# Altium project GMM_TESTER_PA.PrjPcb
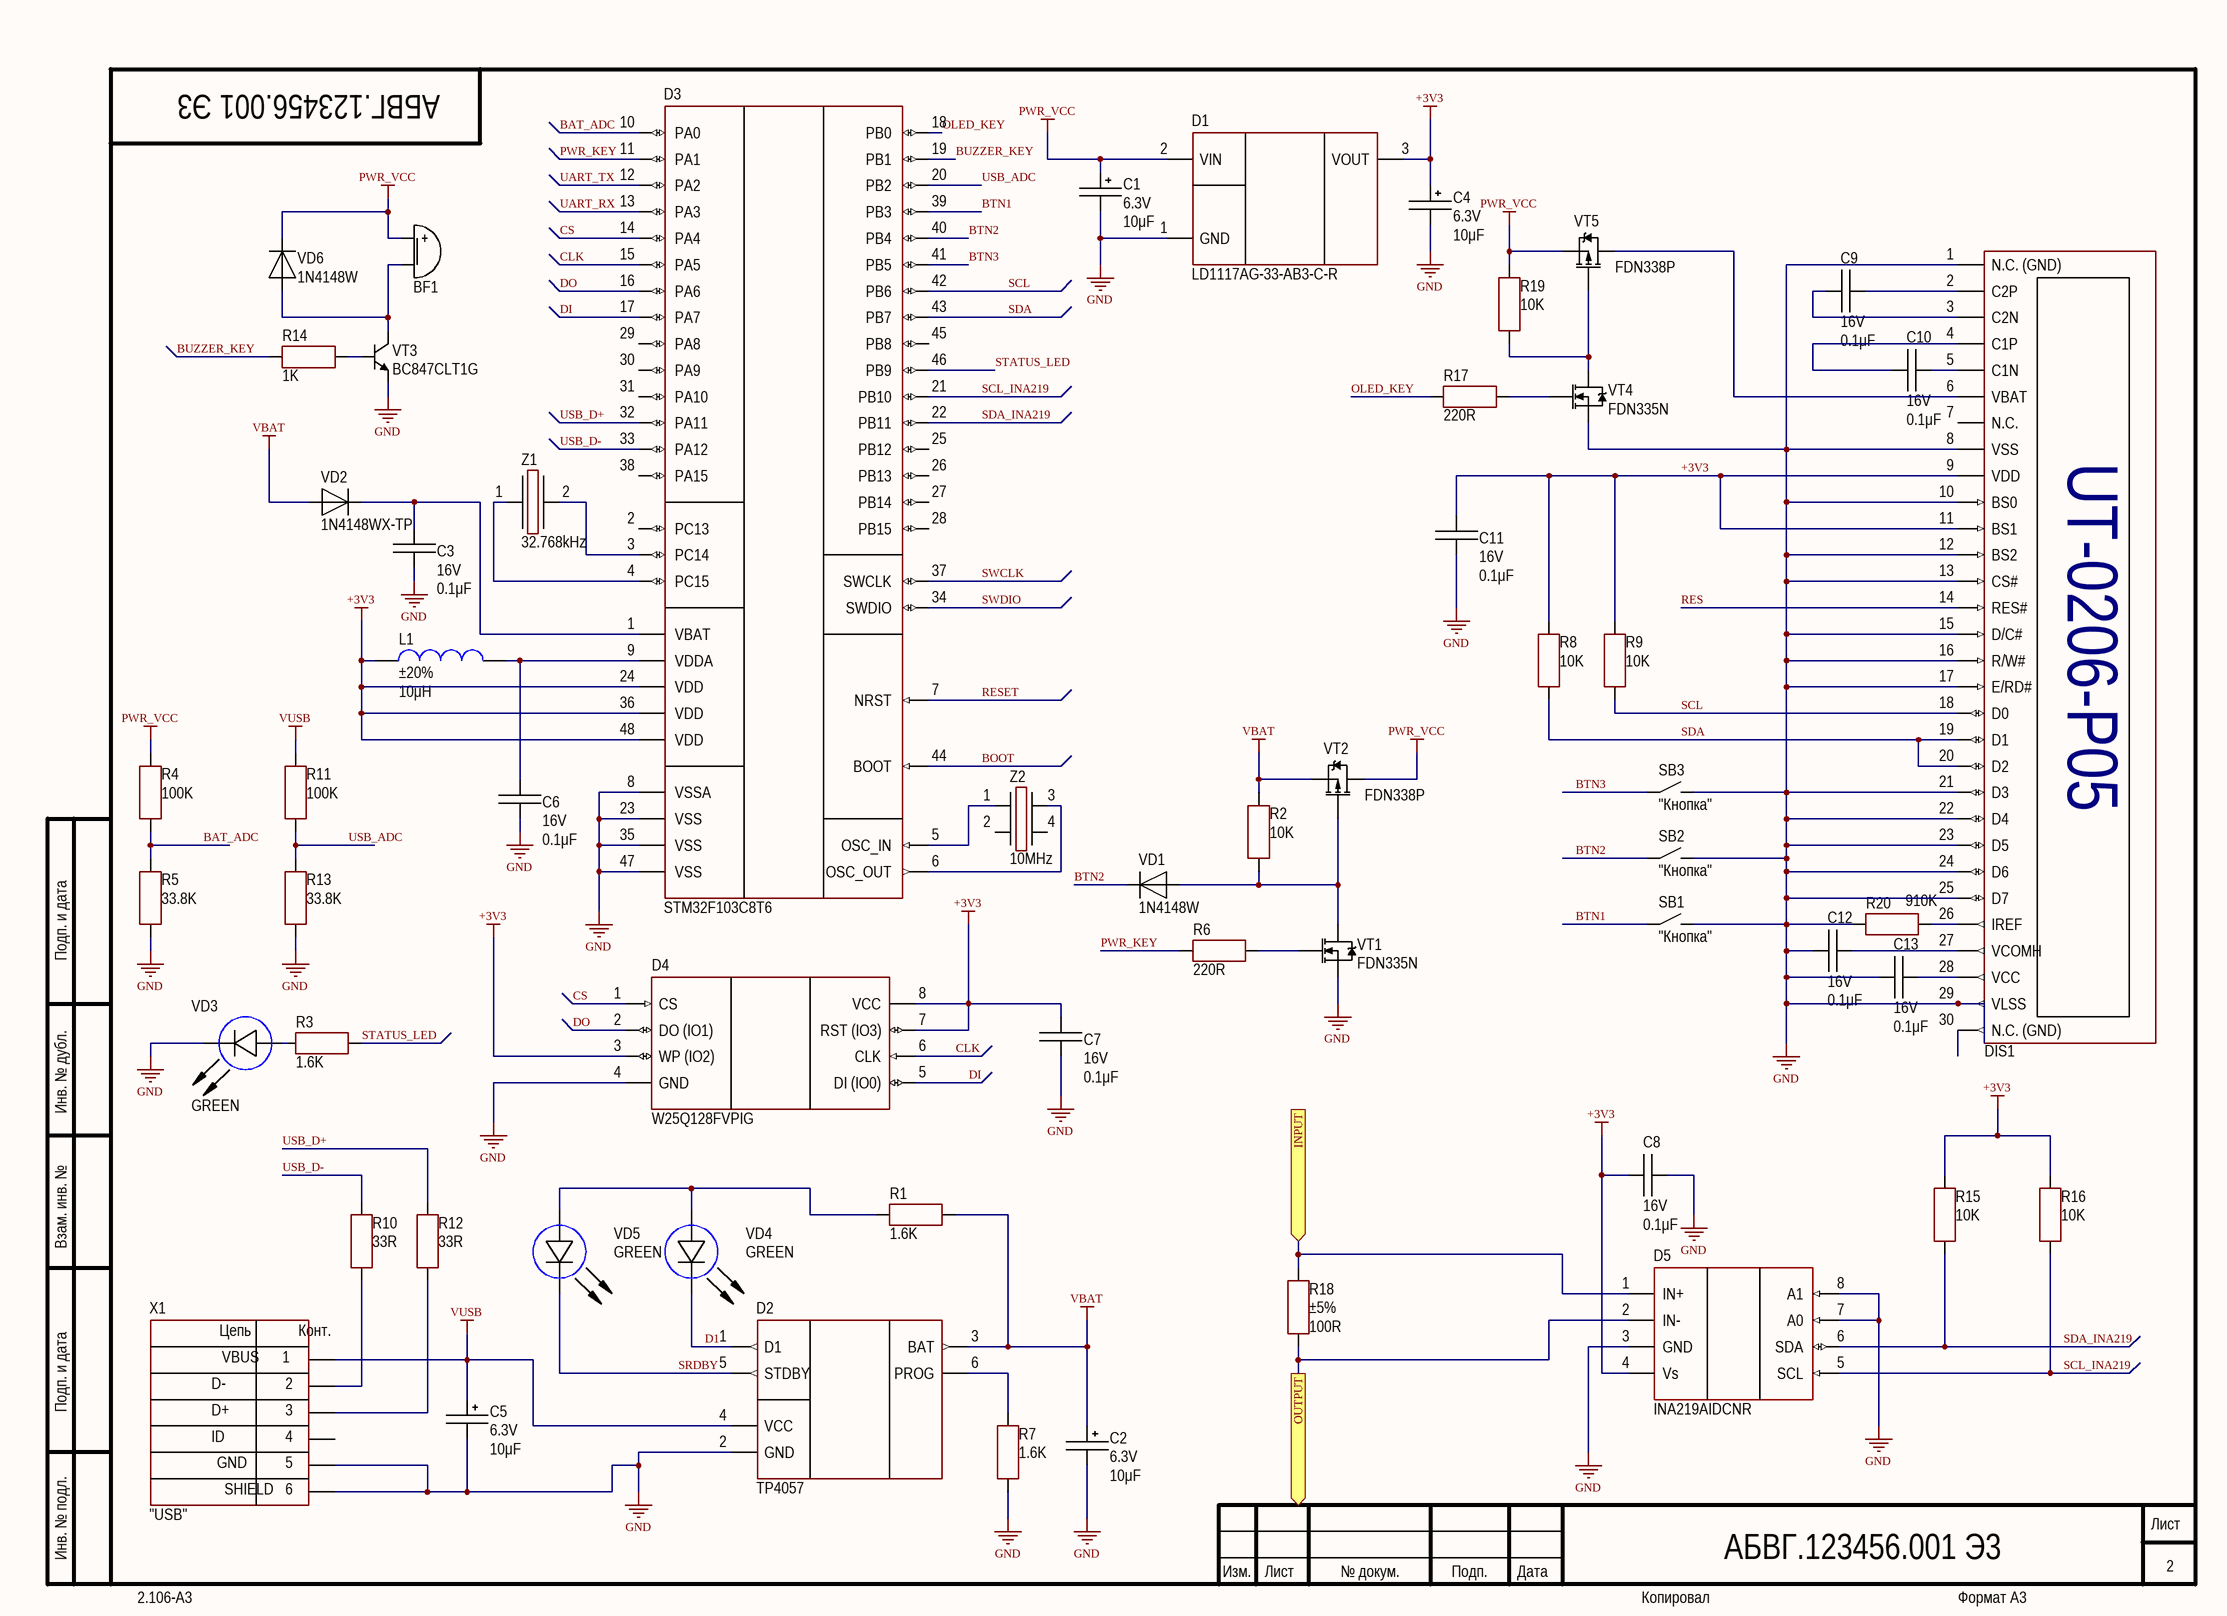
[diagram p0: GMM_TESTER_PA_Sheet1.SchDoc]
2 sheets, 58 parts. Net scope: flat (ports and power ports of the same name join across sheets).
Board file: GMM_TESTER_PA_PCB.PcbDoc
Sheets:
  GMM_TESTER_PA_Sheet1.SchDoc
  GMM_TESTER_PA_Sheet2.SchDoc

## Sheet GMM_TESTER_PA_Sheet1.SchDoc
size 420 x 297 mm; Address1: Address1; Address2: Address2; Address3: Address3; Address4: Address4; DocumentNumber: АБВГ.123456.001 Э3; SheetNumber: 2; Scale: 1:1; DocumentType: Схема электрическая принципиальная; FirstReferrence: АБВГ.123456.001

### Parts
BF1  (no value)  [BUZ: CMT-7525]
C1  value 10μF  Voltage: 6.3V  [CAP: TANTAL-A]
C2  value 10μF  Voltage: 6.3V  [CAP: TANTAL-A]
C3  value 0.1μF  Voltage: 16V  [CAP: 0603]
C4  value 10μF  Voltage: 6.3V  [CAP: TANTAL-A]
C5  value 10μF  Voltage: 6.3V  [CAP: TANTAL-A]
C6  value 0.1μF  Voltage: 16V  [CAP: 0603]
C7  value 0.1μF  Voltage: 16V  [CAP: 0603]
C8  value 0.1μF  Voltage: 16V  [CAP: 0603]
C9  value 0.1μF  Voltage: 16V  [CAP: 0603]
C10  value 0.1μF  Voltage: 16V  [CAP: 0603]
C11  value 0.1μF  Voltage: 16V  [CAP: 0603]
C12  value 0.1μF  Voltage: 16V  [CAP: 0603]
C13  value 0.1μF  Voltage: 16V  [CAP: 0603]
D1  (no value)  [SOT89]
D2  (no value)  [SOT23-6]
D3  (no value)  [48-LQFP]
D4  (no value)  [8-SOIC]
D5  (no value)  [SOT23-8]
DIS1  (no value)  [DISP: OLED UT-0206-P05]
L1  value 10μH  Tolerance: ±20%  [IND: 0603]
R1  value 1.6K  [RES: 0603]
R2  value 10K  [RES: 0603]
R3  value 1.6K  [RES: 0603]
R4  value 100K  [RES: 0603]
R5  value 33.8K  [RES: 0603]
R6  value 220R  [RES: 0603]
R7  value 1.6K  [RES: 0603]
R8  value 10K  [RES: 0603]
R9  value 10K  [RES: 0603]
R10  value 33R  [RES: 0603]
R11  value 100K  [RES: 0603]
R12  value 33R  [RES: 0603]
R13  value 33.8K  [RES: 0603]
R14  value 1K  [RES: 0603]
R15  value 10K  [RES: 0603]
R16  value 10K  [RES: 0603]
R17  value 220R  [RES: 0603]
R18  value 100R  Tolerance: ±5%  [RES: 1206]
R19  value 10K  [RES: 0603]
R20  value 910K  [RES: 0603]
SB1  CommentText: "Кнопка"  [BUT: SKQGADE010 - duplicate]
SB2  CommentText: "Кнопка"  [BUT: SKQGADE010 - duplicate]
SB3  CommentText: "Кнопка"  [BUT: SKQGADE010 - duplicate]
VD1  PartNumber: 1N4148W  [DIODE: SOD123]
VD2  PartNumber: 1N4148WX-TP  [DIODE: SOD123]
VD3  Color: GREEN  [LED: 0805R]
VD4  Color: GREEN  [LED: 0805G]
VD5  Color: GREEN  [LED: 0805R]
VD6  PartNumber: 1N4148W  [DIODE: SOD123]
VT1  PartNumber: FDN335N  [SOT23]
VT2  PartNumber: FDN338P  [SOT23]
VT3  PartNumber: BC847CLT1G  [SOT23]
VT4  PartNumber: FDN335N  [SOT23]
VT5  PartNumber: FDN338P  [SOT23]
X1  CommentText: "USB"  [CON: USB micro-A (ZX62-B-5PA)]
Z1  Frequency: 32.768kHz  [OSC: FC - 12M]
Z2  Frequency: 10MHz  [OSC: 3225]

### Ports
INPUT (in), OUTPUT (out)

### Nets
+3V3: C4.1 C7.1 C8.2 C11.1 D1.3(VOUT) D3.24(VDD) D3.36(VDD) D3.48(VDD) D4.3(WP_(IO2)) D4.7(RST_(IO3)) D4.8(VCC) D5.4(Vs) DIS1.9(VDD) DIS1.11(BS1) L1.2 R8.2 R9.2 R15.2 R16.2
GND: C1.2 C2.2 C3.2 C4.2 C5.2 C6.2 C7.2 C8.1 C11.2 C12.2 C13.2 D1.1(GND) D2.2(GND) D3.8(VSSA) D3.23(VSS) D3.35(VSS) D3.47(VSS) D4.4(GND) D5.3(GND) D5.7(A0) D5.8(A1) DIS1.1(N.C._(GND)) DIS1.8(VSS) DIS1.10(BS0) DIS1.12(BS2) DIS1.13(CS#) DIS1.15(D/C#) DIS1.16(R/W#) DIS1.17(E/RD#) DIS1.21(D3) DIS1.22(D4) DIS1.23(D5) DIS1.24(D6) DIS1.25(D7) DIS1.29(VLSS) R5.1 R7.1 R13.1 R20.1 SB1.2 SB2.2 SB3.2 VD3.2(C) VT1.2(S) VT3.2(E) VT4.2(S) X1.0 X1.5
PWR_VCC: BF1.1(+) C1.1 D1.2(VIN) R4.2 R19.2 VD6.2 VT2.3(D) VT5.2(S)
VBAT: C2.1 D2.3(BAT) R1.1 R2.2 VD2.1 VT2.2(S)
VUSB: C5.1 D2.4(VCC) R11.2 X1.1
BAT_ADC: D3.10(PA0) R4.1 R5.2
BOOT: D3.44(BOOT)
BTN1: D3.39(PB3) SB1.1
BTN2: D3.40(PB4) SB2.1 VD1.2
BTN3: D3.41(PB5) SB3.1
BUZZER_KEY: D3.19(PB1) R14.2
CLK: D3.15(PA5) D4.6(CLK)
CS: D3.14(PA4) D4.1(CS)
D1: D2.1(D1) VD4.2(C)
DI: D3.17(PA7) D4.5(DI_(IO0))
DO: D3.16(PA6) D4.2(DO_(IO1))
OLED_KEY: D3.18(PB0) R17.2
PWR_KEY: D3.11(PA1) R6.2
RES: DIS1.14(RES#)
RESET: D3.7(NRST)
SCL: D3.42(PB6) DIS1.18(D0) R9.1
SCL_INA219: D3.21(PB10) D5.5(SCL) R16.1
SDA: D3.43(PB7) DIS1.19(D1) DIS1.20(D2) R8.1
SDA_INA219: D3.22(PB11) D5.6(SDA) R15.1
SRDBY: D2.5(STDBY) VD5.2(C)
STATUS_LED: D3.46(PB9) R3.1
SWCLK: D3.37(SWCLK)
SWDIO: D3.34(SWDIO)
UART_RX: D3.13(PA3)
UART_TX: D3.12(PA2)
USB_ADC: D3.20(PB2) R11.1 R13.2
USB_D+: D3.32(PA11) R12.2
USB_D-: D3.33(PA12) R10.2
NetBF1_2: BF1.2(-) VD6.1 VT3.3(C)
NetC3_1: C3.1 D3.1(VBAT) VD2.2
NetC6_1: C6.1 D3.9(VDDA) L1.1
NetC9_1: C9.1 DIS1.2(C2P)
NetC9_2: C9.2 DIS1.3(C2N)
NetC10_1: C10.1 DIS1.5(C1N)
NetC10_2: C10.2 DIS1.4(C1P)
NetC12_1: C12.1 DIS1.27(VCOMH)
NetC13_1: C13.1 DIS1.28(VCC)
NetD2_6: D2.6(PROG) R7.2
NetD3_3: D3.3(PC14) Z1.2
NetD3_4: D3.4(PC15) Z1.1
NetD3_5: D3.5(OSC_IN) Z2.1
NetD3_6: D3.6(OSC_OUT) Z2.3
NetD5_1: D5.1(IN+) R18.2 ; port INPUT
NetD5_2: D5.2(IN-) R18.1 ; port OUTPUT
NetDIS1_6: DIS1.6(VBAT) VT5.3(D)
NetDIS1_26: DIS1.26(IREF) R20.2
NetR1_2: R1.2 VD4.1(A) VD5.1(A)
NetR2_1: R2.1 VD1.1 VT1.3(D) VT2.1(G)
NetR3_2: R3.2 VD3.1(A)
NetR6_1: R6.1 VT1.1(G)
NetR10_1: R10.1 X1.2
NetR12_1: R12.1 X1.3
NetR14_1: R14.1 VT3.1(B)
NetR17_1: R17.1 VT4.1(G)
NetR19_1: R19.1 VT4.3(D) VT5.1(G)

Not connected (* = marked no-connect by the designer): D3 2(PC13) 25(PB12) 26(PB13) 27(PB14) 28(PB15) 29(PA8) 30(PA9) 31(PA10) 38(PA15) 45(PB8); DIS1 7(N.C.) 30(N.C._(GND)); X1 4; Z2 2 4

### Notes on the sheet
- Подп. и дата
- Инв. № дубл.
- Взам. инв. №
- Инв. № подл.
- Изм.
- Лист
- № докум.
- Подп.
- Дата
- 2.106-A3
- Копировал
- Формат А3
- (in symbol Connector_USB_micro_B) Цепь; Конт.; VBUS; D-; D+; ID; GND; SHIELD; 6
- (in symbol QG-2864KSWEG01) UT-0206-P05

### Library data of the parts
BF1 = Buzzer: Manufacturer: PUI Audio; ValueManufacturerPartNumber: DIP switch, 2.73 kHz, 3VDC, 80mA, -20...+70°C; PartNumber: AT-0927-TT-6-R; TypeBuzzer: DIP switch; VoltageMax: 3VDC; Frequency: 2.73 kHz; CurrentMax: 80mA; HelpURL: https://www.digikey.com/products/en?keywords=AT-0927-TT-6-R; Temperature: -20...+70°C
C1 C2 C4 C5 = Tantal_A: Manufacturer: AVX; PartNumber: F930J107KAAAJ6; ValueManufacturerPartNumber: Tantalum capacitor, 10μF, 6.3V, ±10%, 2Ohm, case A (3216), -55...+125°C; Impedance: 2Ohm; Tolerance: ±10%; TypeDielectric: X7R; TypeCapacitor: Tantalum capacitor; Package: case A (3216); HelpURL: https://www.digikey.com/product-detail/en/avx-corporation/F930J107KAAAJ6/478-12404-1-ND/9645231; Temperature: -55...+125°C
C3 C6-C13 = Ceramic_0603: Manufacturer: Yageo; PartNumber: CC0603KRX7R7BB104; ValueManufacturerPartNumber: Ceramic capacitor, 0.1μF, X7R, ±10%, 16V, 0603, -55...+125°C; TypeCapacitor: Ceramic capacitor; Tolerance: ±10%; TypeDielectric: X7R; Package: 0603; HelpURL: https://www.digikey.com/product-detail/en/yageo/CC0603KRX7R7BB104/311-1088-1-ND/302998; Temperature: -55...+125°C
D1 = LD1117AG-33-AB3-C-R: Linear voltage regulator; Manufacturer: STMicroelectronics; ValueManufacturerPartNumber: Linear voltage regulator, input 3.9...18V, 0.6V, output 3.3V, 1.2A, -40...+85°C, SOT89; VoltageInput: input 3.9...18V; MaxDropout: 0.6V; CurrentOutput: 1.2A; VoltageOutput: output 3.3V; HelpURL: https://lcsc.com/product-detail/Low-Dropout-Regulators-LDO_Unisonic-Tech-LD1117AG-33-AB3-C-R_C427616.html; Package: SOT89; ComponentType: Linear voltage regulator; Temperature: -40...+85°C; PartNumber: LD1117AG-33-AB3-C-R
D2 = TP4057: 500mA Linear Li-Ion Battery Charger; Manufacturer: Texas Instruments; ValueManufacturerPartNumber: DC/DC push-pull converter, input 2.25...5.5V, 160kHz, , 500ma, -55...+125°C, SOT23-6; VoltageInput: input 2.25...5.5V; Frequency: 160kHz; HelpURL: https://www.digikey.com/product-detail/en/texas-instruments/SN6505ADBVR/296-48949-1-ND/8635012; Package: SOT23-6; ComponentType: DC/DC push-pull converter; Temperature: -55...+125°C; CurrentOutput: 500ma; PartNumber: TP4057
D3 = STM32F103C8T6: Cortex-M3; Manufacturer: STMicroelectronics; ValueManufacturerPartNumber: IC microcontroller, 32-Bit, Cortex-M3, 72MHz, 64KB, 20KB, 2...3.6V, -40...+85°C, 48-LQFP; Supply: 2...3.6V; Speed: 72MHz; CoreSize: 32-Bit; MemoryROM: 64KB; MemoryRAM: 20KB; HelpURL: https://www.digikey.com/product-detail/en/stmicroelectronics/STM32F103C8T6TR/497-17666-1-ND/7804402; Package: 48-LQFP; ComponentType: IC microcontroller; Temperature: -40...+85°C; CoreProcessor: Cortex-M3; PartNumber: STM32F103C8T6
D4 = W25Q128FVPIG: FLASH; Manufacturer: Winbond Electronics; ValueManufacturerPartNumber: IC memory, FLASH, 128Mb (16M x 8), 104 MHz, SPI/QuadSPI, 2.7...3.6V, -40...+85°C, 8-WSON; Supply: 2.7...3.6V; Speed: 104 MHz; InterfaceData: SPI/QuadSPI; MemorySize: 128Mb (16M x 8); HelpURL: https://www.digikey.com/product-detail/en/winbond-electronics/W25Q128FVPIG/W25Q128FVPIG-ND/4037386; Package: 8-WSON; ComponentType: IC memory; Temperature: -40...+85°C; MemoryType: FLASH; PartNumber: W25Q128FVPIG
D5 = INA219AIDCNR: Current monitor; Manufacturer: Texas Instruments; ValueManufacturerPartNumber: IC current monitor, ±3%, 350 kHz, 2.7...5.5V, -40...+125°C, SOT23-6; Supply: 2.7...5.5V; Accuracy: ±3%; GainBandwidth: 350 kHz; HelpURL: https://www.digikey.com/product-detail/en/texas-instruments/INA181A1IDBVR/296-47656-1-ND/8133025; Package: SOT23-6; ComponentType: IC current monitor; Temperature: -40...+125°C; PartNumber: INA219AIDCNR
DIS1 = QG-2864KSWEG01: Manufacturer: Shenzhen Allvision Tech; VoltageMax: 5VDC; ValueManufacturerPartNumber: =TypeButton+', '+Multichannel+', '+VoltageMax+', '+CurrentMax+', '+Temperature; TypeButton: QG-2864KSWEG01; Temperature: -40...+85°C
L1 = Inductor_0603: Manufacturer: Murata Electronics; PartNumber: LQM18FN100M00D; ValueManufacturerPartNumber: Fixed inductor, 10μH, ±20%, 0603, 50mA, -55...+125°C; TypeInductor: Fixed inductor; MaxCurrent: 50mA; Package: 0603; HelpURL: https://www.digikey.com/product-detail/en/murata-electronics-north-america/LQM18FN100M00D/490-4025-1-ND/1016285; Temperature: -55...+125°C
R1-R17 R19 R20 = Resistor_0603: Manufacturer: Yageo; PartNumber: RC0603JR-07100RL; TypeResistor: Resistor film; Power: 0.1W; Package: 0603; HelpURL: https://www.digikey.com/product-detail/en/yageo/RC0603JR-07100RL/311-100GRCT-ND/729644; ValueManufacturerPartNumber: =TypeResistor+', '+Value+', '+Tolerance+', '+Package+', '+Power+', '+Temperature; Temperature: -55...+125°C
R18 = Resistor_1206: Manufacturer: Yageo; PartNumber: RC1206JR-07100RL; ValueManufacturerPartNumber: Resistor film, 100R, ±5%, 1206, 0.25W, -55...+125°C; TypeResistor: Resistor film; Power: 0.25W; Package: 1206; HelpURL: https://www.digikey.com/product-detail/en/yageo/RC1206JR-07100RL/311-100ERCT-ND/732153; Temperature: -55...+125°C
SB1-SB3 = Button_tactile: Manufacturer: TE Connectivity; ValueManufacturerPartNumber: Tactile button, 6x6mm; PartNumber: FSM2JSMAATR; TypeButton: Tactile button; HelpURL: https://www.digikey.com/product-detail/en/te-connectivity-alcoswitch-switches/FSM2JSMAATR/450-1792-1-ND/3503931; Package: 6x6mm
VD1 VD2 VD6 = Diode_single: Manufacturer: Micro Commercial; ValueManufacturerPartNumber: Single diode, 75V, 150mA, 1V, 4ns, SOD-323, -55...+150°C; TypeDiode: Single diode; Voltage: 75V; Current: 150mA; VoltageDrop: 1V; RecoveryTime: 4ns; Package: SOD-323; HelpURL: https://www.digikey.com/product-detail/en/micro-commercial-co/1N4148WX-TP/1N4148WXTPMSCT-ND/717312; Temperature: -55...+150°C
VD3-VD5 = LED_single: ValueManufacturerPartNumber: LED, Green, *, *, *, -55...+150°C; TypeDiode: LED; Manufacturer: *; Package: *; HelpURL: *; Temperature: -55...+150°C; Current: *; VoltageDrop: *; PartNumber: *; ColorParameter: Green
VT1 VT4 = MOSFET_N_132: Manufacturer: Infineon Technologies; ValueManufacturerPartNumber: MOSFET N-channel transistor, 80V, 7A, 9.1nC, 2.5W, 34mOhm, 756pF, 8-TDSON, -55...+150°C; TypeTransistor: MOSFET N-channel transistor; VoltageDS: 80V; CurrentDS: 7A; RDS: 34mOhm; GateCharge: 9.1nC; InputCapacitor: 756pF; MaxPower: 2.5W; Package: 8-TDSON; HelpURL: https://www.digikey.com/product-detail/en/infineon-technologies/BSC340N08NS3GATMA1/BSC340N08NS3GATMA1TR-ND/2080655; Temperature: -55...+150°C
VT2 VT5 = MOSFET_P_132: Manufacturer: Infineon Technologies; ValueManufacturerPartNumber: MOSFET P-channel transistor, 20V, 2.6A, 2.9nC, 2.5W, 135mOhm, 220pF, SOT-23, -55...+150°C; TypeTransistor: MOSFET P-channel transistor; VoltageDS: 20V; CurrentDS: 2.6A; RDS: 135mOhm; GateCharge: 2.9nC; InputCapacitor: 220pF; MaxPower: 2.5W; Package: SOT-23; HelpURL: https://www.digikey.com/product-detail/en/infineon-technologies/IRLML2246TRPBF/IRLML2246TRPBFCT-ND/2639576; Temperature: -55...+150°C
VT3 = BJT_NPN_132: Manufacturer: ON Semiconductor; ValueManufacturerPartNumber: NPN transistor, 45V, 100mA, 100MHz, 300mW, 0.6V, 420, SOT-23, -55...+125°C; TypeTransistor: NPN transistor; VoltageCE: 45V; CurrentCE: 100mA; VoltageSaturation: 0.6V; Frequency: 100MHz; CurrentGain: 420; MaxPower: 300mW; Package: SOT-23; HelpURL: https://www.digikey.com/product-detail/en/on-semiconductor/BC847CLT1G/BC847CLT1GOSCT-ND/917836; Temperature: -55...+125°C
X1 = Connector_USB_micro_B: Manufacturer: Hirose Electric; ValueManufacturerPartNumber: USB micro B; PartNumber: ZX62-B-5PA; HelpURL: https://www.digikey.com/product-detail/en/hirose-electric-co-ltd/ZX62-B-5PA/H11579CT-ND/1851090; TypeConnector: USB micro B
Z1 = Crystal_FC-12M: Manufacturer: Epson; PartNumber: FC-135 32.7680KA-A5; ValueManufacturerPartNumber: Crystal, 32.768kHz, 12.5pF, ±20ppm, case 3215, -40...+85°C; LoadCapacitance: 12.5pF; Tolerance: ±20ppm; Package: case 3215; HelpURL: https://www.digikey.com/product-detail/en/epson/FC-135-32.7680KA-A5/SER4103CT-ND/6188447; Temperature: -40...+85°C; TypeOscilator: Crystal
Z2 = Crystal_3225: Manufacturer: Diodes Incorporated; PartNumber: FL1000002; ValueManufacturerPartNumber: Crystal, 10MHz, 12pF, ±25ppm, case 3225, -40...+85°C; LoadCapacitance: 12pF; Tolerance: ±25ppm; Package: case 3225; HelpURL: https://www.digikey.com/product-detail/en/diodes-incorporated/FL1000002/FL1000002CT-ND/6042078; Temperature: -40...+85°C; TypeOscilator: Crystal

## Sheet GMM_TESTER_PA_Sheet2.SchDoc
size 420 x 297 mm; Address1: Address1; Address2: Address2; Address3: Address3; Address4: Address4; DocumentNumber: АБВГ.123456.001 Э3; SheetNumber: 2; Scale: 1:1; DocumentType: Схема электрическая принципиальная; FirstReferrence: АБВГ.123456.001

### Notes on the sheet
- Подп. и дата
- Инв. № дубл.
- Взам. инв. №
- Инв. № подл.
- Изм.
- Лист
- № докум.
- Подп.
- Дата
- 2.106-A3
- Копировал
- Формат А3